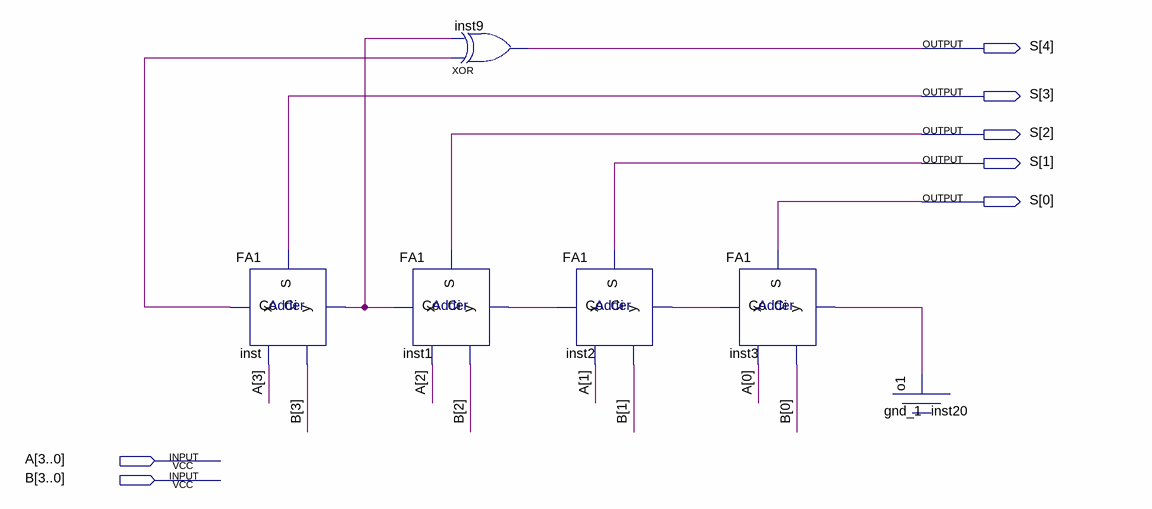
[diagram p0: schematic sheet]
// Quartus schematic FA4.bdf as structural Verilog: 6 symbols, 7 pins
module FA4 (
  input  [3:0] A,
  input  [3:0] B,
  output [4:0] S
);

  wire inst1_co, inst2_co, inst3_co, inst20_o1, inst_co;

  FA1 inst (.x(A[3]), .y(B[3]), .Ci(inst1_co), .Co(inst_co), .S(S[3]));
  FA1 inst1 (.x(A[2]), .y(B[2]), .Ci(inst2_co), .Co(inst1_co), .S(S[2]));
  xor inst9 (S[4], inst_co, inst1_co);
  FA1 inst2 (.x(A[1]), .y(B[1]), .Ci(inst3_co), .Co(inst2_co), .S(S[1]));
  FA1 inst3 (.x(A[0]), .y(B[0]), .Ci(inst20_o1), .Co(inst3_co), .S(S[0]));
  gnd_1 inst20 (.o1(inst20_o1));
endmodule
